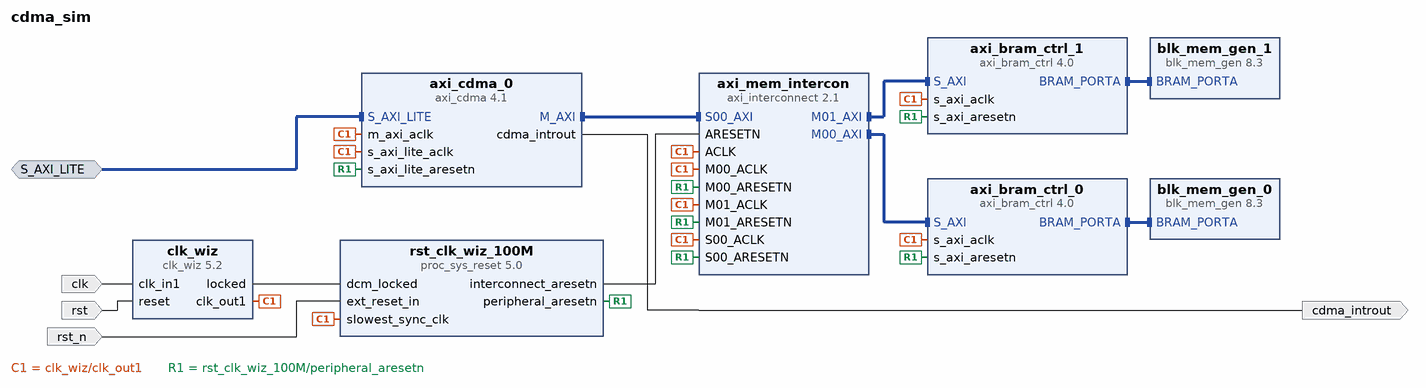
[diagram p0: block diagram of the top level]
# Vivado block design cdma_sim, Vivado 2015.4
create_bd_design cdma_sim

create_bd_intf_port -mode Slave -vlnv xilinx.com:interface:aximm_rtl:1.0 S_AXI_LITE
set_property -dict [list \
  CONFIG.DATA_WIDTH 32 \
  CONFIG.PROTOCOL AXI4LITE \
  CONFIG.FREQ_HZ 100000000 \
  CONFIG.ID_WIDTH 0 \
  CONFIG.ADDR_WIDTH 16 \
  CONFIG.AWUSER_WIDTH 0 \
  CONFIG.ARUSER_WIDTH 0 \
  CONFIG.WUSER_WIDTH 0 \
  CONFIG.RUSER_WIDTH 0 \
  CONFIG.BUSER_WIDTH 0 \
  CONFIG.READ_WRITE_MODE READ_WRITE \
  CONFIG.HAS_BURST 0 \
  CONFIG.HAS_LOCK 0 \
  CONFIG.HAS_PROT 0 \
  CONFIG.HAS_CACHE 0 \
  CONFIG.HAS_QOS 0 \
  CONFIG.HAS_REGION 0 \
  CONFIG.HAS_WSTRB 0 \
  CONFIG.HAS_BRESP 1 \
  CONFIG.HAS_RRESP 1 \
  CONFIG.SUPPORTS_NARROW_BURST 0 \
  CONFIG.NUM_READ_OUTSTANDING 1 \
  CONFIG.NUM_WRITE_OUTSTANDING 1 \
  CONFIG.MAX_BURST_LENGTH 1 \
  CONFIG.PHASE 0.000 \
] [get_bd_intf_ports S_AXI_LITE]
create_bd_port -dir I -type clk clk
set_property -dict {CONFIG.FREQ_HZ 100000000 CONFIG.PHASE 0.000} [get_bd_ports clk]
create_bd_port -dir I -type rst rst
set_property -dict {CONFIG.POLARITY ACTIVE_HIGH} [get_bd_ports rst]
create_bd_port -dir O -type intr cdma_introut
create_bd_port -dir I -type rst rst_n
set_property -dict {CONFIG.POLARITY ACTIVE_LOW} [get_bd_ports rst_n]

create_bd_cell -type ip -vlnv xilinx.com:ip:axi_bram_ctrl:4.0 axi_bram_ctrl_0
set_property -dict {CONFIG.SINGLE_PORT_BRAM 1} [get_bd_cells axi_bram_ctrl_0]
create_bd_cell -type ip -vlnv xilinx.com:ip:blk_mem_gen:8.3 blk_mem_gen_0
set_property -dict [list \
  CONFIG.Memory_Type Single_Port_RAM \
  CONFIG.Enable_32bit_Address false \
  CONFIG.Use_Byte_Write_Enable false \
  CONFIG.Write_Depth_A 4096 \
  CONFIG.Register_PortA_Output_of_Memory_Primitives true \
  CONFIG.Load_Init_File false \
  CONFIG.Fill_Remaining_Memory_Locations true \
  CONFIG.Remaining_Memory_Locations fafa0505 \
  CONFIG.Use_RSTA_Pin false \
  CONFIG.Port_B_Clock 0 \
  CONFIG.Port_B_Write_Rate 0 \
  CONFIG.Port_B_Enable_Rate 0 \
  CONFIG.use_bram_block Stand_Alone \
] [get_bd_cells blk_mem_gen_0]
create_bd_cell -type ip -vlnv xilinx.com:ip:axi_bram_ctrl:4.0 axi_bram_ctrl_1
set_property -dict {CONFIG.SINGLE_PORT_BRAM 1} [get_bd_cells axi_bram_ctrl_1]
create_bd_cell -type ip -vlnv xilinx.com:ip:blk_mem_gen:8.3 blk_mem_gen_1
set_property -dict [list \
  CONFIG.Enable_32bit_Address false \
  CONFIG.Use_Byte_Write_Enable false \
  CONFIG.Write_Depth_A 4096 \
  CONFIG.Register_PortA_Output_of_Memory_Primitives true \
  CONFIG.Use_RSTA_Pin false \
  CONFIG.use_bram_block Stand_Alone \
] [get_bd_cells blk_mem_gen_1]
create_bd_cell -type ip -vlnv xilinx.com:ip:axi_cdma:4.1 axi_cdma_0
set_property -dict {CONFIG.C_INCLUDE_SG 0} [get_bd_cells axi_cdma_0]
create_bd_cell -type ip -vlnv xilinx.com:ip:axi_interconnect:2.1 axi_mem_intercon
set_property -dict {CONFIG.NUM_MI 2} [get_bd_cells axi_mem_intercon]
create_bd_cell -type ip -vlnv xilinx.com:ip:clk_wiz:5.2 clk_wiz
set_property -dict {CONFIG.USE_BOARD_FLOW true CONFIG.CLK_IN1_BOARD_INTERFACE sys_clock} [get_bd_cells clk_wiz]
create_bd_cell -type ip -vlnv xilinx.com:ip:proc_sys_reset:5.0 rst_clk_wiz_100M

# ---- connections ----

connect_bd_intf_net [get_bd_intf_pins axi_mem_intercon/M00_AXI] [get_bd_intf_pins axi_bram_ctrl_0/S_AXI]
connect_bd_intf_net [get_bd_intf_pins blk_mem_gen_0/BRAM_PORTA] [get_bd_intf_pins axi_bram_ctrl_0/BRAM_PORTA]
connect_bd_intf_net [get_bd_intf_pins axi_mem_intercon/M01_AXI] [get_bd_intf_pins axi_bram_ctrl_1/S_AXI]
connect_bd_intf_net [get_bd_intf_pins axi_bram_ctrl_1/BRAM_PORTA] [get_bd_intf_pins blk_mem_gen_1/BRAM_PORTA]
connect_bd_intf_net [get_bd_intf_pins axi_cdma_0/M_AXI] [get_bd_intf_pins axi_mem_intercon/S00_AXI]
connect_bd_intf_net [get_bd_intf_ports S_AXI_LITE] [get_bd_intf_pins axi_cdma_0/S_AXI_LITE]
connect_bd_net [get_bd_pins clk_wiz/clk_out1] \
  [get_bd_pins axi_cdma_0/m_axi_aclk] [get_bd_pins rst_clk_wiz_100M/slowest_sync_clk] \
  [get_bd_pins axi_bram_ctrl_0/s_axi_aclk] [get_bd_pins axi_bram_ctrl_1/s_axi_aclk] [get_bd_pins axi_cdma_0/s_axi_lite_aclk] \
  [get_bd_pins axi_mem_intercon/S00_ACLK] [get_bd_pins axi_mem_intercon/ACLK] [get_bd_pins axi_mem_intercon/M00_ACLK] \
  [get_bd_pins axi_mem_intercon/M01_ACLK]
connect_bd_net [get_bd_pins clk_wiz/locked] [get_bd_pins rst_clk_wiz_100M/dcm_locked]
connect_bd_net [get_bd_pins rst_clk_wiz_100M/peripheral_aresetn] \
  [get_bd_pins axi_bram_ctrl_0/s_axi_aresetn] [get_bd_pins axi_bram_ctrl_1/s_axi_aresetn] \
  [get_bd_pins axi_cdma_0/s_axi_lite_aresetn] [get_bd_pins axi_mem_intercon/S00_ARESETN] \
  [get_bd_pins axi_mem_intercon/M00_ARESETN] [get_bd_pins axi_mem_intercon/M01_ARESETN]
connect_bd_net [get_bd_pins rst_clk_wiz_100M/interconnect_aresetn] [get_bd_pins axi_mem_intercon/ARESETN]
connect_bd_net -net sys_clock_1 [get_bd_ports clk] [get_bd_pins clk_wiz/clk_in1]
connect_bd_net -net reset_rtl_1 [get_bd_ports rst] [get_bd_pins clk_wiz/reset]
connect_bd_net [get_bd_pins axi_cdma_0/cdma_introut] [get_bd_ports cdma_introut]
connect_bd_net -net reset_rtl_2 [get_bd_ports rst_n] [get_bd_pins rst_clk_wiz_100M/ext_reset_in]

# ---- address map ----
assign_bd_address -offset 0x00001000 -range 4K -target_address_space [get_bd_addr_spaces axi_cdma_0/Data] [get_bd_addr_segs axi_bram_ctrl_0/S_AXI/Mem0]
assign_bd_address -offset 0x00002000 -range 4K -target_address_space [get_bd_addr_spaces axi_cdma_0/Data] [get_bd_addr_segs axi_bram_ctrl_1/S_AXI/Mem0]
assign_bd_address -offset 0x0000 -range 4K -target_address_space [get_bd_addr_spaces S_AXI_LITE] [get_bd_addr_segs axi_cdma_0/S_AXI_LITE/Reg]

validate_bd_design
save_bd_design
